# EAGLE design Nixie Design Block (EAGLE 9.6.2)
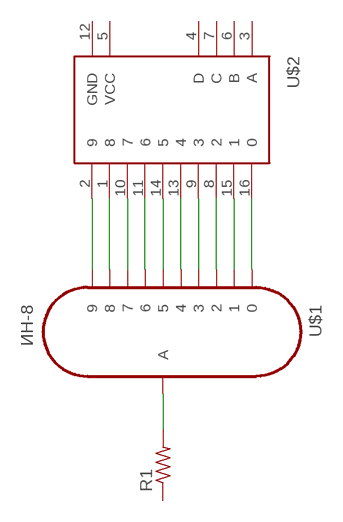
[diagram p0: schematic, sheet 1]

## Parts
R1  R-US_M0805  [M0805]
U$1  ИН-8  IN-8IN-8_SOCKET  [IN-8_SOCKET]
U$2  K155ID1  [DIL16-KIT]

## Nets
N$1: U$1.9 U$2.2
N$2: U$1.8 U$2.1
N$3: U$1.7 U$2.10
N$4: U$1.6 U$2.11
N$5: U$1.5 U$2.14
N$6: U$1.4 U$2.13
N$7: U$1.3 U$2.9
N$8: U$1.2 U$2.8
N$9: U$1.1 U$2.15
N$10: U$1.0 U$2.16
N$11: R1.2 U$1.A
Unconnected: R1.1 U$2.3(A) U$2.4(D) U$2.5(VCC) U$2.6(B) U$2.7(C) U$2.12(GND)

## Library data of the parts
R1 = rcl:R-US_: RESISTOR, American symbol; SPICEPREFIX: R
U$1 = russian-nixies:IN-8
U$2 = russian-nixies:K155ID1

## Board
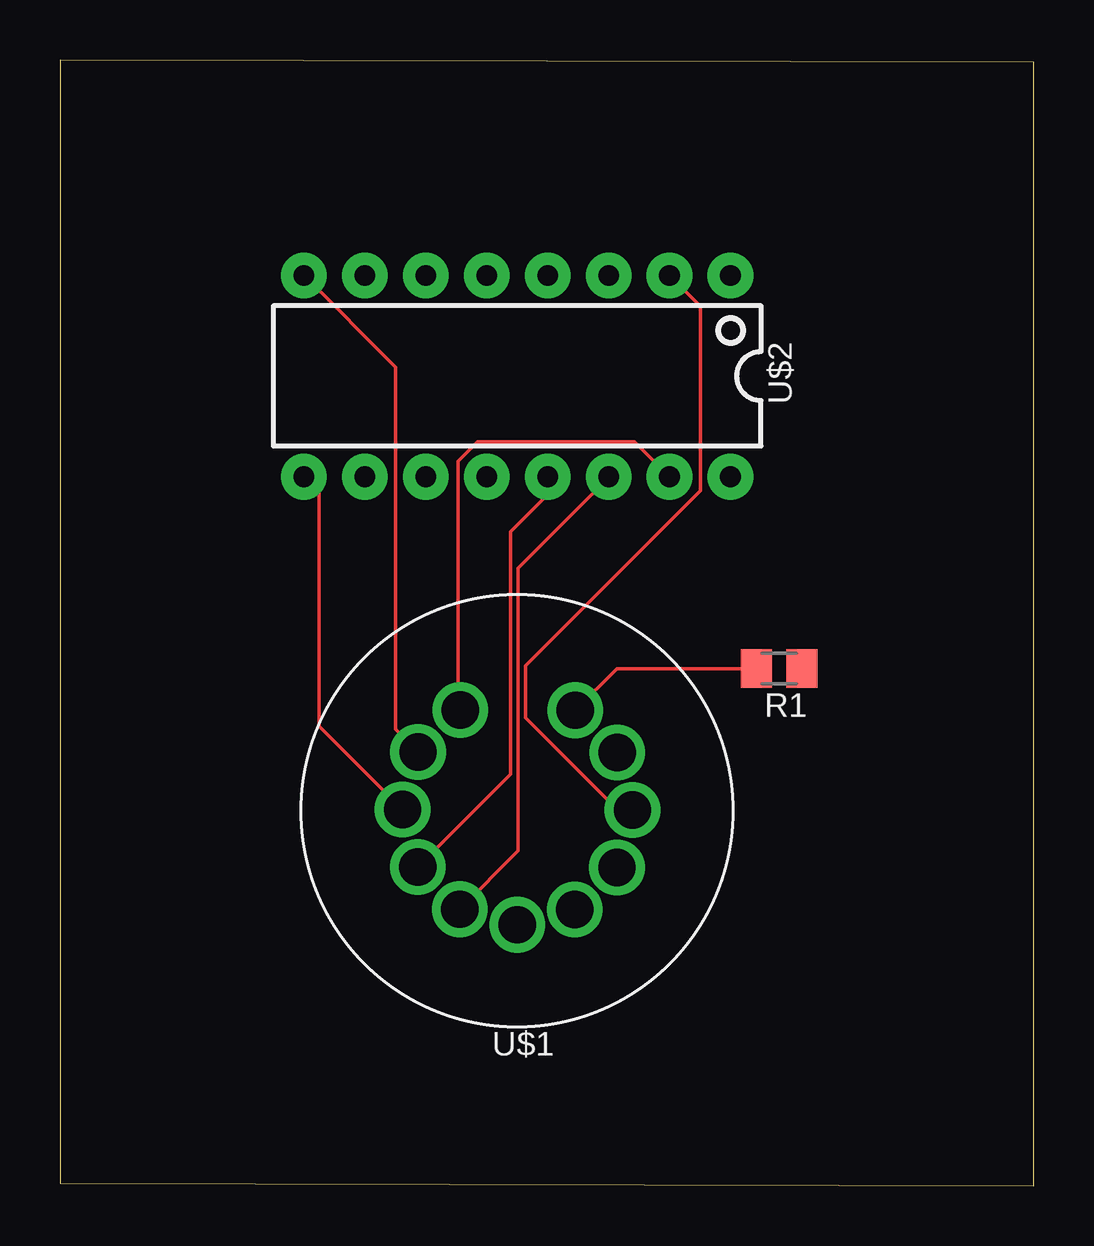
[diagram p1: board, top side]
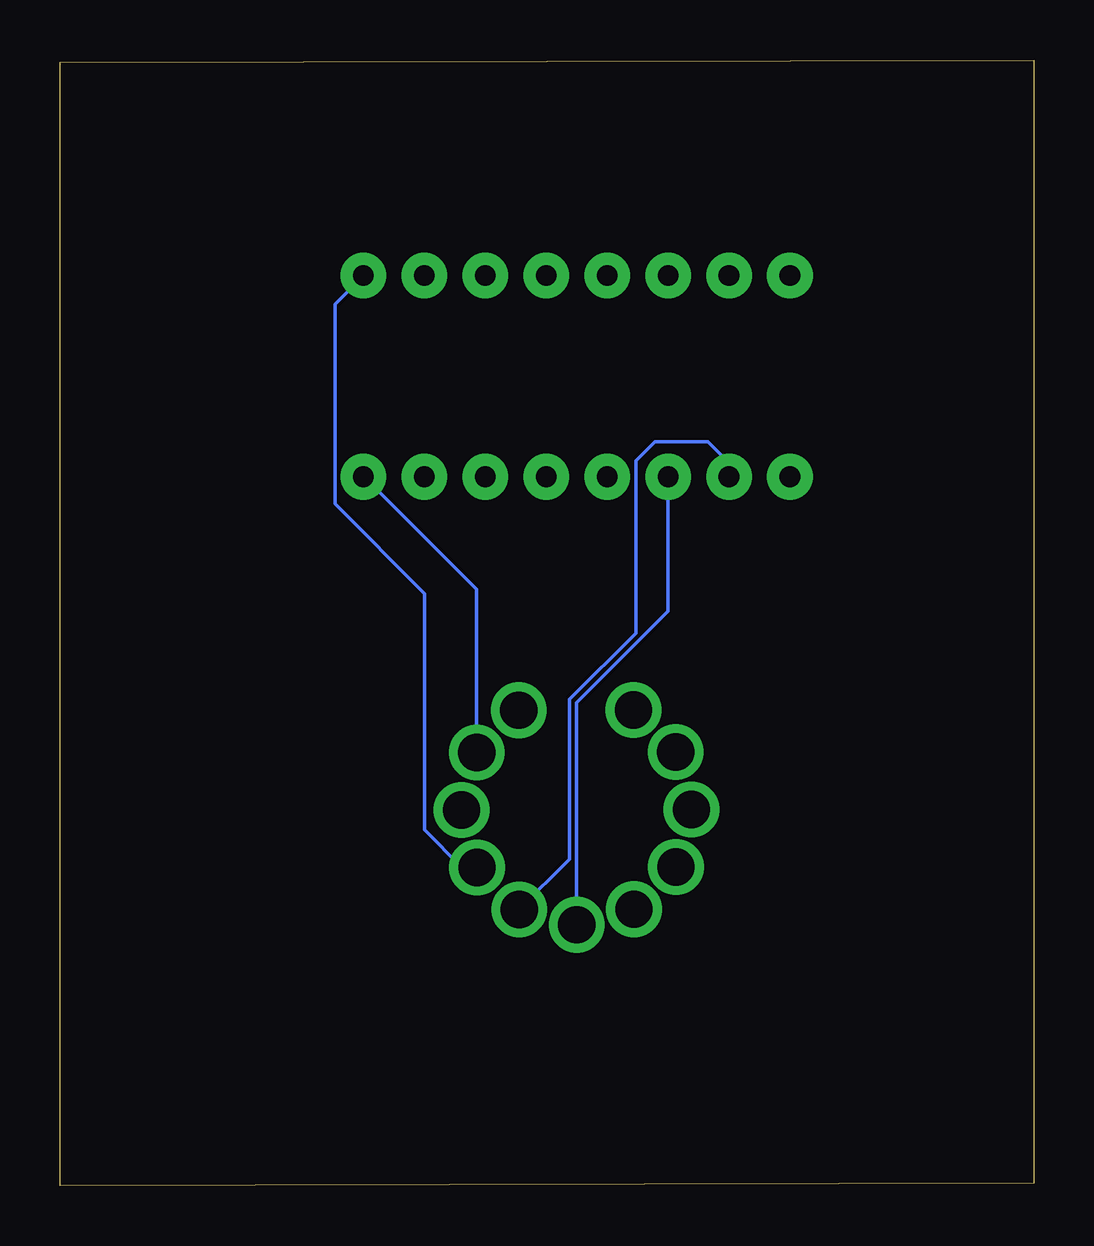
[diagram p2: board, bottom side, seen from below]

Size 40.6 x 46.9 mm. Coordinates in mm from the lower left corner, seen from the top.
Outline: 0,0.1 40.6,0 40.6,46.8 0,46.9 0,0.1
Copper layers (1*16): Top 0.035mm / dielectric 1.5mm / Bottom 0.035mm
Design rules "default": minimum track width 6mil, minimum drill 0.35mm, track to track 6mil, track to pad 6mil, pad to pad 6mil, via to via 6mil, smd to smd 6mil, copper to edge 40mil, drill to drill 6mil, minimum pad ring 10mil, minimum via ring 8mil, stop-mask expansion 4mil, vias tented up to drill 0mil, thermal gap 10mil

### Footprints (pad centres in the part's own frame; a part is rotated, then mirrored left to right if it is on the bottom)
M0805 = smd 1.3 x 1.6: 1 -0.95,0; 2 0.95,0
IN-8_SOCKET = drill 1.55: 0 4.167,7.173; 1 -2.371,8.944; 2 -4.129,7.196; 3 -4.777,4.803; 4 -4.142,2.406; 5 -2.393,0.648; 6 0,0; 7 2.397,0.635; 8 4.154,2.384; 9 4.803,4.777; A 2.419,8.931
DIL16-KIT = drill 0.864 pad 1.905: 1 -8.89,-4.191; 2 -6.35,-4.191; 3 -3.81,-4.191; 4 -1.27,-4.191; 5 1.27,-4.191; 6 3.81,-4.191; 7 6.35,-4.191; 8 8.89,-4.191; 9 8.89,4.191; 10 6.35,4.191; 11 3.81,4.191; 12 1.27,4.191; 13 -1.27,4.191; 14 -3.81,4.191; 15 -6.35,4.191; 16 -8.89,4.191

### Placement (x,y rotation side)
R1  29.98,21.54 180 top
U$1  19.06,10.87 0 top
U$2  19.06,33.73 180 top

### Tracks (layer width: path | path; a pad name or v marks a point on that pad's centre or on a via)
N$1
  Top 0.152: U$1.9 23.25,15.65 19.4,19.5 19.4,21.66 26.7,28.96 26.7,36.63 U$2.2
N$2
  Bottom 0.152: U$1.8 23.84,13.25 25.4,14.82 25.4,24.67 29.13,28.4 29.13,36.73 28.34,37.52 28.34,37.53 U$2.1
N$3
  Bottom 0.152: U$2.10 12.71,30.11 13.6,31 15.8,31 16.6,30.2 16.6,23.02 19.36,20.26 19.36,13.6 U$1.7
N$4
  Bottom 0.152: U$1.6 19.06,20.13 15.25,23.94 U$2.11
N$5
  Top 0.152: U$2.14 22.87,29.5 19.09,25.73 19.09,13.95 U$1.5
N$6
  Top 0.152: U$1.4 18.79,17.15 18.79,27.25 20.33,28.79 U$2.13
N$7
  Top 0.152: U$1.3 14.26,15.67 10.79,19.13 10.79,28.91 U$2.9
N$8
  Top 0.152: U$1.2 13.99,19.01 13.99,34.1 U$2.8
N$9
  Top 0.152: U$2.15 23.95,31 17.4,31 16.59,30.19 16.59,19.91 U$1.1
N$10
  Bottom 0.152: U$2.16 27.92,29.54 23.23,24.84 U$1.0
N$11
  Top 0.152: U$1.A 23.22,21.54 R1.2